# EAGLE design Digital Input Reader and Protection Circuit (EAGLE 9.6.2)
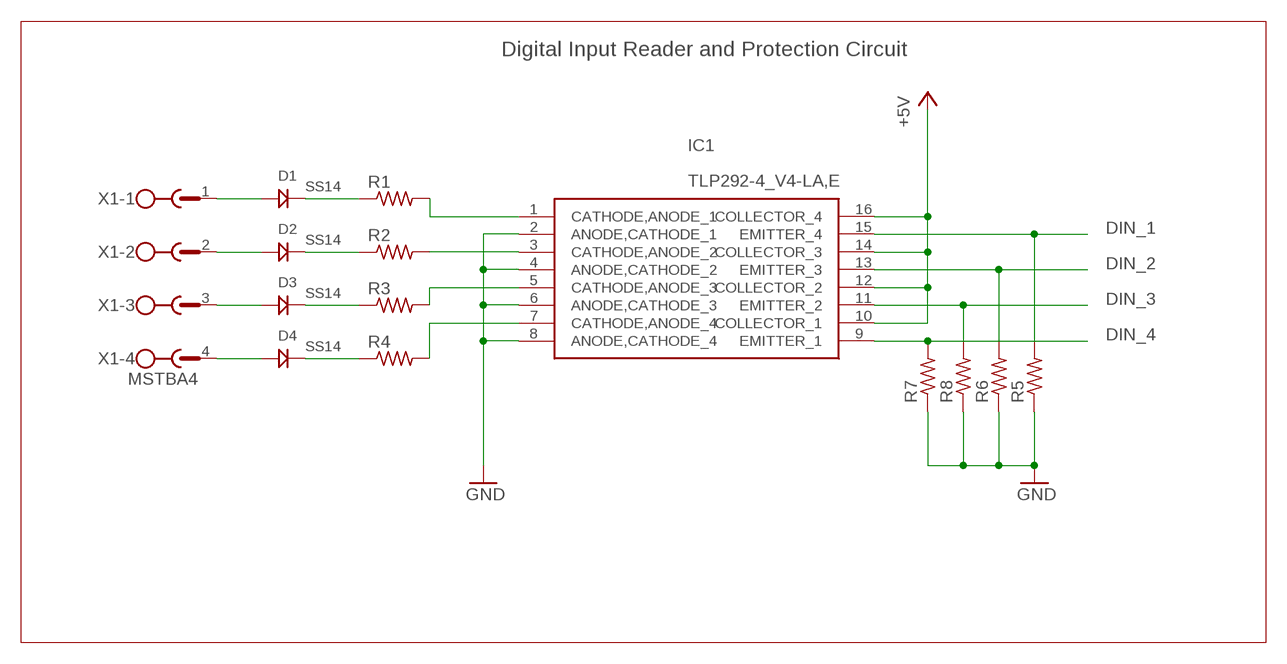
[diagram p0: schematic, sheet 1]

## Parts
D1  SS14  [DO214]
D2  SS14  [DO214]
D3  SS14  [DO214]
D4  SS14  [DO214]
IC1  TLP292-4_V4-LA,E  [SOIC127P700X230-16N]
R1  R-US_R0805  [R0805]
R2  R-US_R0805  [R0805]
R3  R-US_R0805  [R0805]
R4  R-US_R0805  [R0805]
R5  R-US_R0805  [R0805]
R6  R-US_R0805  [R0805]
R7  R-US_R0805  [R0805]
R8  R-US_R0805  [R0805]
X1  MSTBA4  [MSTBA4]

## Nets
+5V: IC1.10(COLLECTOR_1) IC1.12(COLLECTOR_2) IC1.14(COLLECTOR_3) IC1.16(COLLECTOR_4)
DIN_1: IC1.15(EMITTER_4) R5.2
DIN_2: IC1.13(EMITTER_3) R6.2
DIN_3: IC1.11(EMITTER_2) R8.2
DIN_4: IC1.9(EMITTER_1) R7.2
GND: IC1.2(ANODE,CATHODE_1) IC1.4(ANODE,CATHODE_2) IC1.6(ANODE,CATHODE_3) IC1.8(ANODE,CATHODE_4) R5.1 R6.1 R7.1 R8.1
N$1: D1.ANODE X1.1
N$2: D1.CATHODE(KATHODE) R1.1
N$3: D2.ANODE X1.2
N$4: D2.CATHODE(KATHODE) R2.1
N$5: D3.ANODE X1.3
N$6: D3.CATHODE(KATHODE) R3.1
N$7: D4.ANODE X1.4
N$8: D4.CATHODE(KATHODE) R4.1
N$9: IC1.1(CATHODE,ANODE_1) R1.2
N$10: IC1.3(CATHODE,ANODE_2) R2.2
N$11: IC1.5(CATHODE,ANODE_3) R3.2
N$12: IC1.7(CATHODE,ANODE_4) R4.2

## Notes on the sheet
- Digital Input Reader and Protection Circuit

## Library data of the parts
D1-D4 = PC_Diode_SS14:SS14; AVAILABILITY: Unavailable; DESCRIPTION: SS14 Series 500 mV 1 A 40 V Max Reverse Voltage Schottky Rectifier - DO-214AC; MF: ON Semiconductor; MP: SS14; PACKAGE: DO-214AC-214 ON Semiconductor; PRICE: None
IC1 = TLP292-4_V4-LA_E:TLP292-4_V4-LA,E: Transistor Output Optocouplers 4ch Transistor opto coupler Source: Datasheet <https://toshiba.semicon-storage.com/info/docget.jsp?did=15284&prodName=TLP292-4>; ARROW_PART_NUMBER: TLP292-4(V4-LA,E; ARROW_PRICE-STOCK: https://www.arrow.com/en/products/tlp292-4-v4-lae/toshiba; DESCRIPTION: Transistor Output Optocouplers 4ch Transistor opto coupler; HEIGHT: 2.3mm; MANUFACTURER_NAME: Toshiba; MANUFACTURER_PART_NUMBER: TLP292-4(V4-LA,E; MOUSER_PART_NUMBER: 757-TLP292-4V4-LAE; MOUSER_PRICE-STOCK: https://www.mouser.co.uk/ProductDetail/Toshiba/TLP292-4V4-LAE/?qs=U6BGiFaJGDu8%2FJbgoJjwwg%3D%3D
R1-R8 = rcl:R-US_: RESISTOR, American symbol; SPICEPREFIX: R
X1 = con-phoenix-508:MSTBA4: PHOENIX; MF: FARNELL; MPN: 1757268; OC_FARNELL: 3705195; OC_NEWARK: 71C4163

## Board
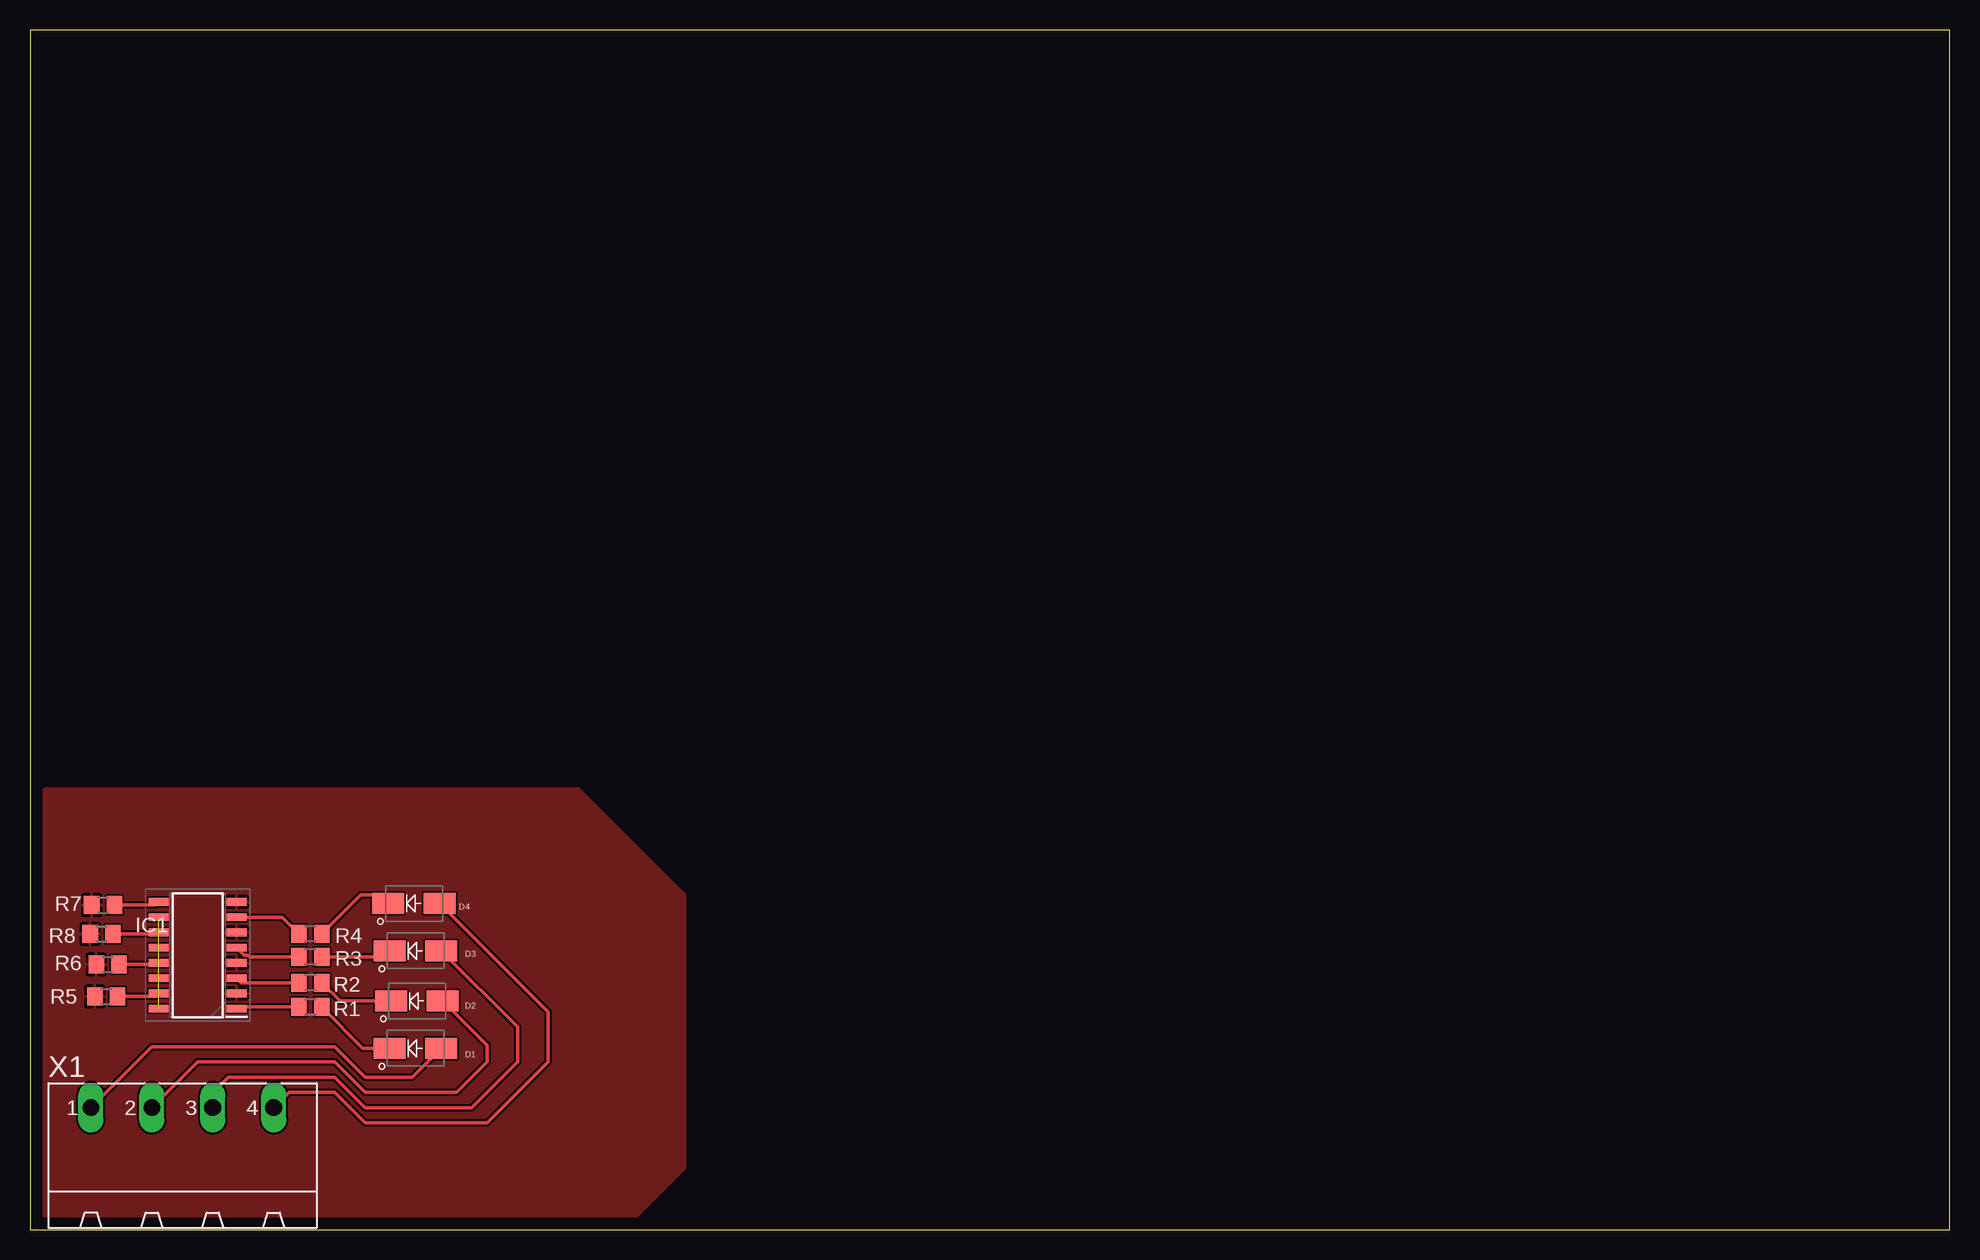
[diagram p1: board, top side]

Size 160 x 100 mm. Coordinates in mm from the lower left corner, seen from the top.
Outline: 0,0 160,0 160,100 0,100 0,0
Copper layers (1*16): Top 0.035mm / dielectric 1.5mm / Bottom 0.035mm
Design rules "default": minimum track width 6mil, minimum drill 0.35mm, track to track 6mil, track to pad 6mil, pad to pad 6mil, via to via 6mil, smd to smd 6mil, copper to edge 40mil, drill to drill 6mil, minimum pad ring 10mil, minimum via ring 8mil, stop-mask expansion 4mil, vias tented up to drill 0mil, thermal gap 10mil

### Footprints (pad centres in the part's own frame; a part is rotated, then mirrored left to right if it is on the bottom)
DO214 = smd 2.65 x 1.75: ANODE -2.15,0; CATHODE 2.15,0
SOIC127P700X230-16N = smd 1.65 x 0.65: 1 -3.25,4.445; 2 -3.25,3.175; 3 -3.25,1.905; 4 -3.25,0.635; 5 -3.25,-0.635; 6 -3.25,-1.905; 7 -3.25,-3.175; 8 -3.25,-4.445; 9 3.25,-4.445; 10 3.25,-3.175; 11 3.25,-1.905; 12 3.25,-0.635; 13 3.25,0.635; 14 3.25,1.905; 15 3.25,3.175; 16 3.25,4.445
R0805 = smd 1.3 x 1.5: 1 -0.95,0; 2 0.95,0
MSTBA4 = drill 1.397 long: 1 -7.62,5.08; 2 -2.54,5.08; 3 2.54,5.08; 4 7.62,5.08

### Placement (x,y rotation side)
D1  32.13,15.11 180 top
D2  32.26,19.05 180 top
D3  32.13,23.24 180 top
D4  32,27.18 180 top
IC1  13.97,22.86 180 top
R1  23.37,18.54 180 top
R2  23.37,20.57 180 top
R3  23.37,22.73 180 top
R4  23.37,24.64 180 top
R5  6.35,19.43 0 top
R6  6.48,22.1 0 top
R7  6.1,27.05 0 top
R8  5.97,24.64 0 top
X1  12.7,5.08 0 top

### Tracks (layer width: path | path; a pad name or v marks a point on that pad's centre or on a via)
+5V  (3 unrouted)
DIN_1
  Top 0.305: R5.2 10.47,19.43 IC1.15
DIN_2
  Top 0.305: R6.2 10.59,22.1 IC1.13
DIN_3
  Top 0.305: R8.2 10.59,24.64 IC1.11
DIN_4
  Top 0.305: R7.2 10.47,27.05 IC1.9
GND
  pour Top: 1.27,36.83 45.72,36.83 54.61,27.94 54.61,5.08 49.53,0 0,0 0,35.56
N$1
  Top 0.305: X1.1 10.16,15.24 25.4,15.24 27.94,12.7 31.87,12.7 D1.ANODE
N$2
  Top 0.305: D1.CATHODE 27.75,15.11 R1.1
N$3
  Top 0.305: X1.2 13.97,13.97 25.4,13.97 27.94,11.43 35.56,11.43 38.1,13.97 38.1,15.36 D2.ANODE
N$4
  Top 0.305: D2.CATHODE 25.84,19.05 R2.1
N$5
  Top 0.305: X1.3 15.24,11.43 16.51,12.7 25.4,12.7 27.94,10.16 36.83,10.16 40.64,13.97 40.64,16.88 D3.ANODE
N$6
  Top 0.305: D3.CATHODE 29.47,22.73 R3.1
N$7
  Top 0.305: X1.4 21.59,11.43 25.4,11.43 27.94,8.89 38.1,8.89 43.18,13.97 43.18,18.15 D4.ANODE
N$8
  Top 0.305: 29.09,27.94 29.15,27.88 | 29.15,27.88 D4.CATHODE | R4.1 27.56,27.88 29.15,27.88
N$9
  Top 0.305: R1.2 17.35,18.54 IC1.1
N$10
  Top 0.305: R2.2 17.6,20.57 IC1.3
N$11
  Top 0.305: R3.2 18.29,22.73 18.17,22.86 17.86,22.86 IC1.5
N$12
  Top 0.305: R4.2 21.02,26.04 IC1.7